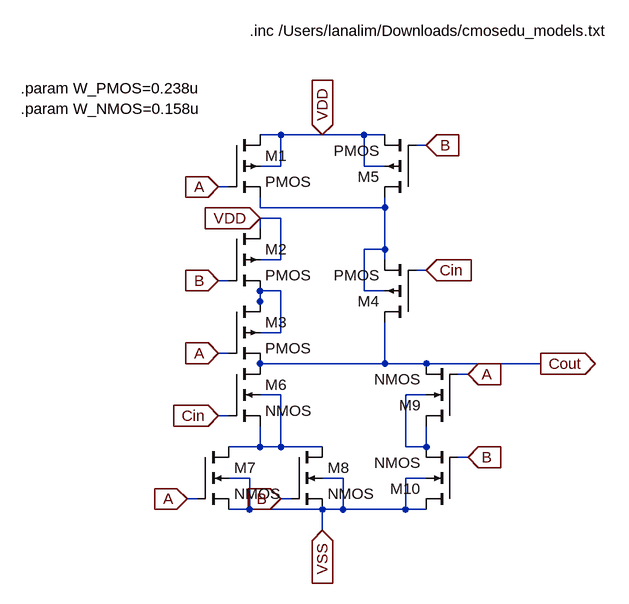
[diagram p0: schematic cmp0_final_sized.asc]
cmp0_final_sized.asc, the LTspice schematic file:
Version 4
SHEET 1 1556 736
WIRE 560 32 528 32
WIRE 624 32 560 32
WIRE 688 32 624 32
WIRE 720 32 688 32
WIRE 784 48 768 48
WIRE 560 80 560 32
WIRE 560 80 528 80
WIRE 688 80 688 32
WIRE 720 80 688 80
WIRE 480 112 464 112
WIRE 528 144 528 128
WIRE 720 144 720 128
WIRE 720 144 528 144
WIRE 560 160 528 160
WIRE 528 176 528 160
WIRE 720 208 720 144
WIRE 720 208 688 208
WIRE 560 224 560 160
WIRE 560 224 528 224
WIRE 720 224 720 208
WIRE 784 240 768 240
WIRE 480 256 464 256
WIRE 560 272 528 272
WIRE 688 272 688 208
WIRE 720 272 688 272
WIRE 528 288 528 272
WIRE 528 304 528 288
WIRE 560 336 560 272
WIRE 560 336 528 336
WIRE 480 368 464 368
WIRE 720 384 720 320
WIRE 720 384 528 384
WIRE 784 384 720 384
WIRE 960 384 784 384
WIRE 848 400 832 400
WIRE 560 432 528 432
WIRE 784 432 752 432
WIRE 480 464 464 464
WIRE 528 512 528 480
WIRE 528 512 480 512
WIRE 560 512 560 432
WIRE 560 512 528 512
WIRE 624 512 560 512
WIRE 752 512 752 432
WIRE 784 512 784 480
WIRE 784 512 752 512
WIRE 848 528 832 528
WIRE 512 560 480 560
WIRE 656 560 624 560
WIRE 784 560 752 560
WIRE 432 592 416 592
WIRE 576 592 560 592
WIRE 512 608 512 560
WIRE 512 608 480 608
WIRE 624 608 512 608
WIRE 656 608 656 560
WIRE 656 608 624 608
WIRE 752 608 752 560
WIRE 752 608 656 608
WIRE 784 608 752 608
WIRE 624 640 624 608
FLAG 464 112 A
IOPIN 464 112 In
FLAG 464 256 B
IOPIN 464 256 In
FLAG 464 368 A
IOPIN 464 368 In
FLAG 784 48 B
IOPIN 784 48 In
FLAG 784 240 Cin
IOPIN 784 240 In
FLAG 624 32 VDD
IOPIN 624 32 In
FLAG 464 464 Cin
IOPIN 464 464 In
FLAG 416 592 A
IOPIN 416 592 In
FLAG 560 592 B
IOPIN 560 592 In
FLAG 848 528 B
IOPIN 848 528 In
FLAG 848 400 A
IOPIN 848 400 In
FLAG 960 384 Cout
IOPIN 960 384 Out
FLAG 624 640 VSS
IOPIN 624 640 In
FLAG 528 160 VDD
IOPIN 528 160 In
SYMBOL pmos4 480 32 R0
SYMATTR InstName M1
SYMATTR Value2 l=1e-7 w={W_PMOS}
SYMBOL pmos4 480 176 R0
SYMATTR InstName M2
SYMATTR Value2 l=1e-7 w={W_PMOS}
SYMBOL pmos4 480 288 R0
SYMATTR InstName M3
SYMATTR Value2 l=1e-7 w={W_PMOS}
SYMBOL pmos4 768 320 R180
SYMATTR InstName M4
SYMATTR Value2 l=1e-7 w={W_PMOS}
SYMBOL pmos4 768 128 R180
SYMATTR InstName M5
SYMATTR Value2 l=1e-7 w={W_PMOS}
SYMBOL nmos4 480 384 R0
SYMATTR InstName M6
SYMATTR Value2 l=1e-7 w={W_NMOS}
SYMBOL nmos4 432 512 R0
SYMATTR InstName M7
SYMATTR Value2 l=1e-7 w={W_NMOS}
SYMBOL nmos4 576 512 R0
SYMATTR InstName M8
SYMATTR Value2 l=1e-7 w={W_NMOS}
SYMBOL nmos4 832 480 R180
SYMATTR InstName M9
SYMATTR Value2 l=1e-7 w={W_NMOS}
SYMBOL nmos4 832 608 R180
SYMATTR InstName M10
SYMATTR Value2 l=1e-7 w={W_NMOS}
TEXT 512 -128 Left 2 !.inc /Users/lanalim/Downloads/cmosedu_models.txt
TEXT 160 -40 Left 2 !.param W_PMOS=0.238u
TEXT 160 -8 Left 2 !.param W_NMOS=0.158u

The netlist it stands for:
* cmp0_final_sized.asc
M1 VDD A N001 VDD PMOS l=1e-7 w={W_PMOS}
M2 VDD B N002 VDD PMOS l=1e-7 w={W_PMOS}
M3 N002 A Cout N002 PMOS l=1e-7 w={W_PMOS}
M4 Cout Cin N001 N001 PMOS l=1e-7 w={W_PMOS}
M5 N001 B VDD VDD PMOS l=1e-7 w={W_PMOS}
M6 Cout Cin N003 N003 NMOS l=1e-7 w={W_NMOS}
M7 N003 A VSS VSS NMOS l=1e-7 w={W_NMOS}
M8 N003 B VSS VSS NMOS l=1e-7 w={W_NMOS}
M9 N004 A Cout N004 NMOS l=1e-7 w={W_NMOS}
M10 VSS B N004 VSS NMOS l=1e-7 w={W_NMOS}
.model NMOS NMOS
.model PMOS PMOS
.lib standard.mos
.inc /Users/lanalim/Downloads/cmosedu_models.txt
.param W_PMOS=0.238u
.param W_NMOS=0.158u
.backanno
.end